# Altium schematic sheet MusicReact.SchDoc
size A4
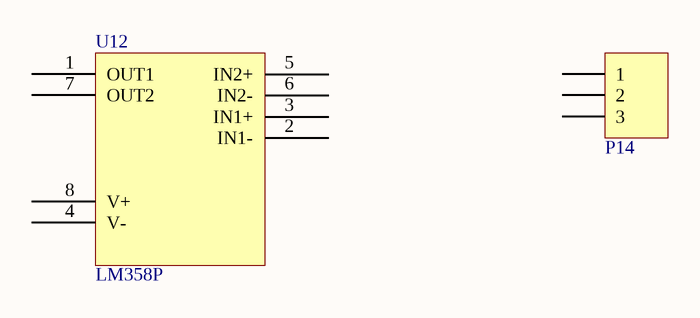
[diagram p0: MusicReact.SchDoc]

## Parts
P14  Header 3  [JP3]  (value not drawn)
U12  LM358P  [LM358P]

## Nets

Not connected (* = marked no-connect by the designer): P14 1 2 3; U12 1(OUT1) 2(IN1-) 3(IN1+) 4(V-) 5(IN2+) 6(IN2-) 7(OUT2) 8(V+)

## Library data of the parts
P14 = Header 3: Header, 3-Pin; LatestRevisionDate: 17-Jul-2002; LatestRevisionNote: Re-released for DXP Platform.; Publisher: Altium Limited